# EAGLE design SparkFun-NEO-F9P (EAGLE 9.6.2)
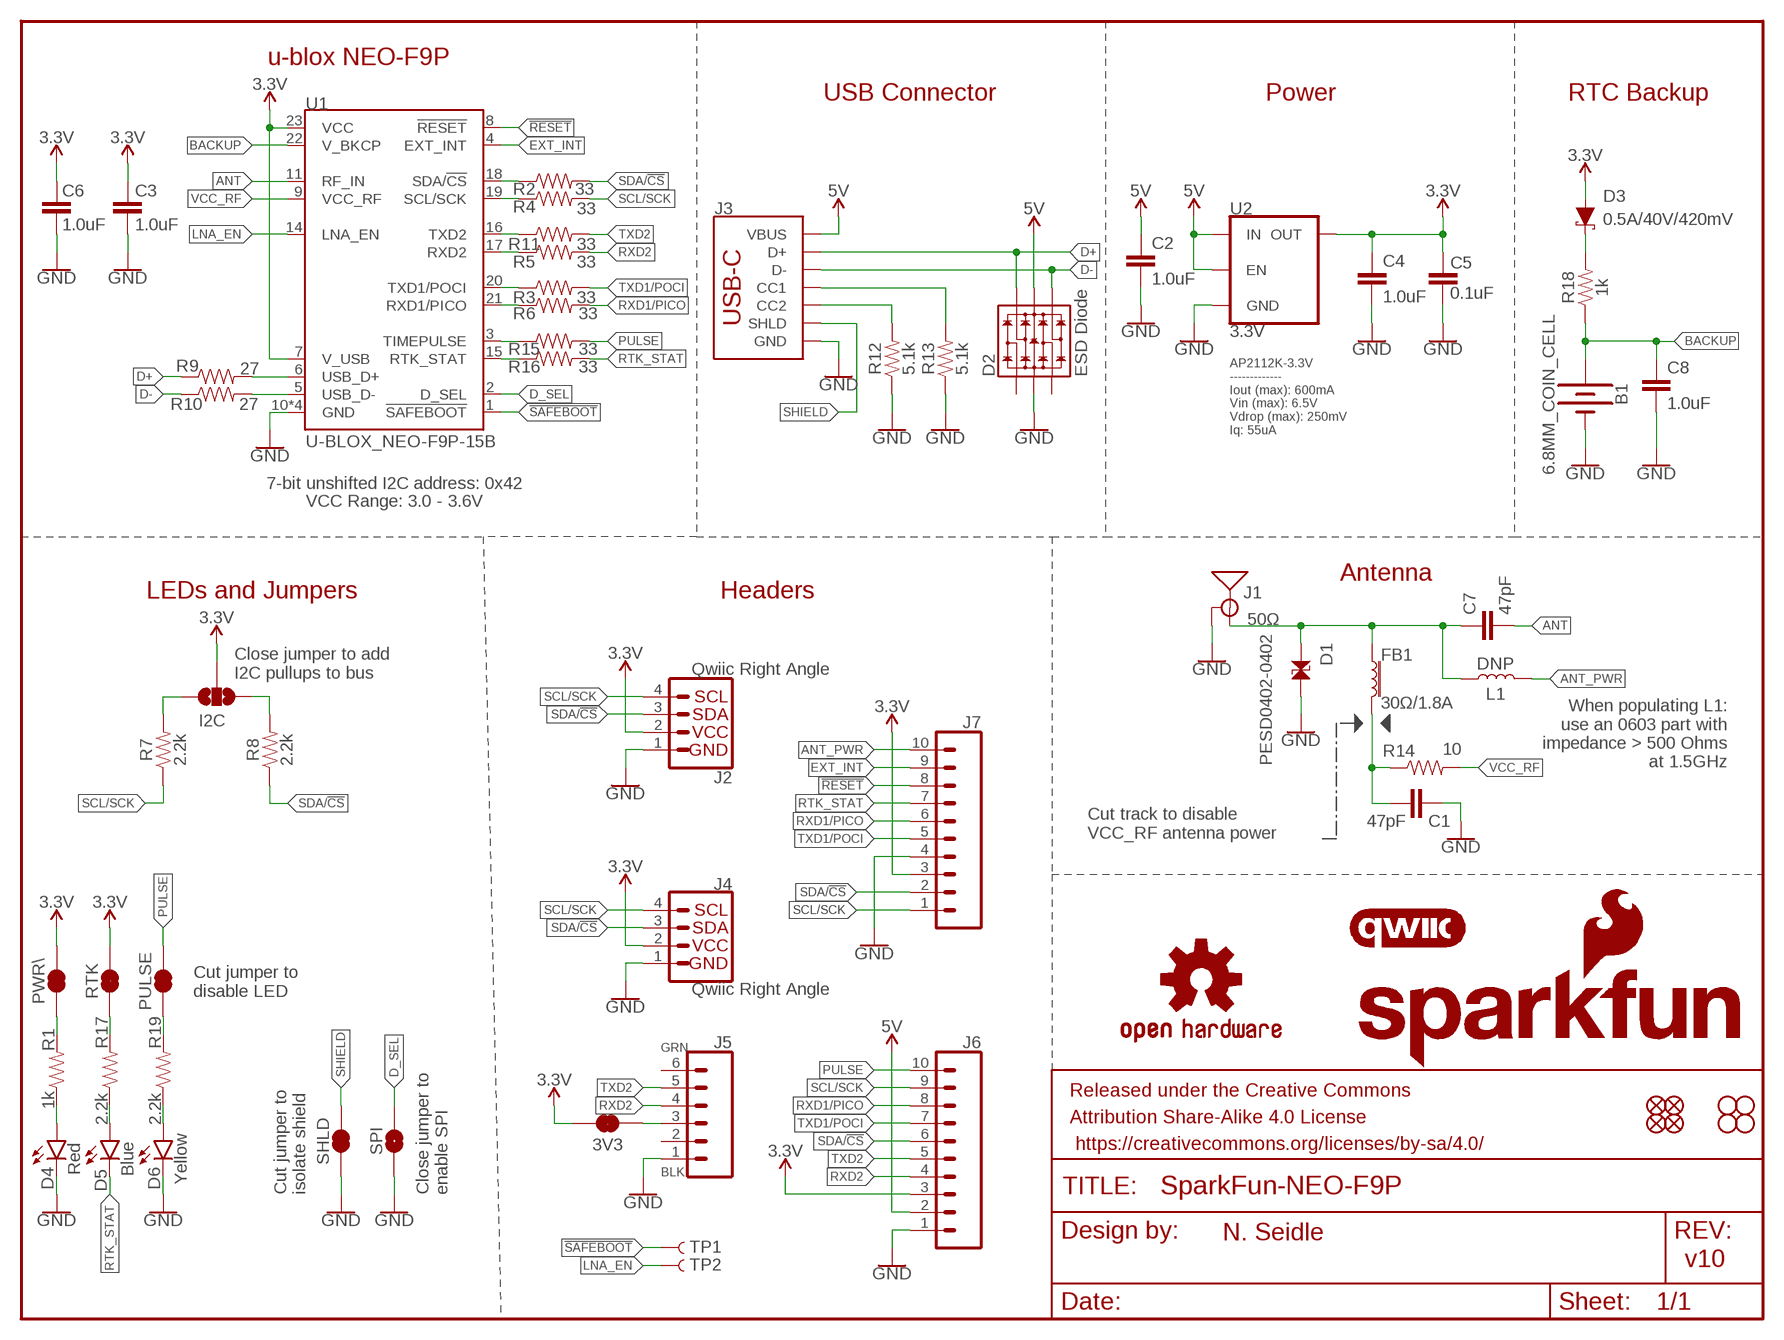
[diagram p0: schematic, sheet 1]

## Parts
3V3  JUMPER-SMT_2_NC_TRACE_SILK  [SMT-JUMPER_2_NC_TRACE_SILK]
B1  6.8MM_COIN_CELL  ML414H_IV01E_BATTERY  [ML414H_IV01E]
C1  47pF  47PF-0603-50V-5%  [0603]
C2  1.0uF  1.0UF-0603-16V-10%  [0603]
C3  1.0uF  1.0UF-0603-16V-10%  [0603]
C4  1.0uF  1.0UF-0603-16V-10%  [0603]
C5  0.1uF  0.1UF-0603-25V-(+80/-20%)  [0603]
C6  1.0uF  1.0UF-0603-16V-10%  [0603]
C7  47pF  47PF-0603-50V-5%  [0603]
C8  1.0uF  1.0UF-0603-16V-10%-X7R  [0603]
D1  PESD0402-0402  [0402]
D2  ESD Diode  TVS_DIODE_ARRAY_DT1042-04SO-7  [SOT-23-6]
D3  0.5A/40V/420mV  DIODE-SCHOTTKY-PMEG4005EJ  [SOD-323]
D4  Red  LED-RED0603  [LED-0603]
D5  Blue  LED-BLUE0603  [LED-0603]
D6  Yellow  LED-YELLOW0603  [LED-0603]
FB1  30Ω/1.8A  FERRITE_BEAD-0603  [0603]
FRAME1  FRAME-LETTER  [CREATIVE_COMMONS]
I2C  JUMPER-SMT_3_NO_SILK  [SMT-JUMPER_3_NO_SILK]
J1  ANTENNA-SMA-GROUNDEDEDGE_SMA  [SMA-EDGE]
J2  Qwiic Right Angle  I2C_STANDARDQWIIC  [JST04_1MM_RA]
J3  USB_C_2-LAYER_PADS  [USB-C-16P-2LAYER-PADS]
J4  Qwiic Right Angle  I2C_STANDARDQWIIC  [JST04_1MM_RA]
J5  CONN_06NO_SILK_FEMALE_PTH  [1X06_NO_SILK]
J6  CONN_10NO_SILK_PTH_FEMALE  [1X10_NO_SILK]
J7  CONN_10NO_SILK_PTH_FEMALE  [1X10_NO_SILK]
JP21  FIDUCIALUFIDUCIAL  [MICRO-FIDUCIAL]
JP31  STAND-OFF  [STAND-OFF]
JP41  STAND-OFF  [STAND-OFF]
JP61  FIDUCIALUFIDUCIAL  [MICRO-FIDUCIAL]
JP71  FIDUCIALUFIDUCIAL  [MICRO-FIDUCIAL]
JP81  FIDUCIALUFIDUCIAL  [MICRO-FIDUCIAL]
JP91  STAND-OFF  [STAND-OFF]
JP101  STAND-OFF  [STAND-OFF]
L1  DNP  DNP-0603_NO-CREAM  [0603_NO-CREAM]
LOGO2  SFE_LOGO_NAME_FLAME.1_INCH  [SFE_LOGO_NAME_FLAME_.1]
LOGO3  SFE_LOGO_NAME_FLAME7_MM  [SFE_LOGO_NAME_FLAME_7MM]
LOGO4  OSHW-LOGOS  [OSHW-LOGO-S]
LOGO5  QWIIC_LOGO_5MM  [QWIIC_5MM]
PULSE  JUMPER-SMT_2_NC_TRACE_SILK  [SMT-JUMPER_2_NC_TRACE_SILK]
PWR\  JUMPER-SMT_2_NC_TRACE_SILK  [SMT-JUMPER_2_NC_TRACE_SILK]
R1  1k  1KOHM-0603-1/10W-1%  [0603]
R2  33  33OHM-0603-1/10W-1%  [0603]
R3  33  33OHM-0603-1/10W-1%  [0603]
R4  33  33OHM-0603-1/10W-1%  [0603]
R5  33  33OHM-0603-1/10W-1%  [0603]
R6  33  33OHM-0603-1/10W-1%  [0603]
R7  2.2k  2.2KOHM-0603-1/10W-1%  [0603]
R8  2.2k  2.2KOHM-0603-1/10W-1%  [0603]
R9  27  27OHM-0603-1/10W-1%  [0603]
R10  27  27OHM-0603-1/10W-1%  [0603]
R11  33  33OHM-0603-1/10W-1%  [0603]
R12  5.1k  5.1KOHM5.1KOHM-0603-1/10W-1%  [0603]
R13  5.1k  5.1KOHM5.1KOHM-0603-1/10W-1%  [0603]
R14  10  10OHM-0603-1/10W-1%  [0603]
R15  33  33OHM-0603-1/10W-1%  [0603]
R16  33  33OHM-0603-1/10W-1%  [0603]
R17  2.2k  2.2KOHM-0603-1/10W-1%  [0603]
R18  1k  1KOHM-0603-1/10W-1%  [0603]
R19  2.2k  2.2KOHM-0603-1/10W-1%  [0603]
RTK  JUMPER-SMT_2_NC_TRACE_SILK  [SMT-JUMPER_2_NC_TRACE_SILK]
SHLD  JUMPER-SMT_2_NC_TRACE_SILK  [SMT-JUMPER_2_NC_TRACE_SILK]
SPI  JUMPER-SMT_2_NO_SILK  [SMT-JUMPER_2_NO_SILK]
TP1  TEST-POINTPOGO_PTH  [1X01_NO_SILK]
TP2  TEST-POINTPOGO_PTH  [1X01_NO_SILK]
U1  U-BLOX_NEO-F9P-15B  [NEO-M9N/M8T/M8U/D9S/F9P]
U2  3.3V  V_REG_AP2112K-3.3V  [SOT23-5]

## Nets
3.3V [3.3V]: 3V3.2 C3.1 C4.1 C5.2 C6.1 D3.A I2C.2 J2.2 J4.2 J6.3 J7.3 PWR\.2 RTK.2 U1.7(V_USB) U1.23(VCC) U2.5(OUT)
5V: C2.1 D2.5(VCC) J3.VBUS1(VBUS) J3.VBUS2(VBUS) J6.2 U2.1(IN) U2.3(EN)
!RESET!: J7.8 U1.8(!RESET!)
!SAFEBOOT!: TP1.1 U1.1(!SAFEBOOT!)
ANT: C7.2 U1.11(RF_IN)
ANT_PWR: J7.10 L1.2
ANT_VCC: C1.1 FB1.2 R14.1
BACKUP: B1.+ C8.1 R18.1 U1.22(V_BKCP)
D+: D2.6(IO4) J3.A6(D+) J3.B6(D+) R9.1
D-: D2.4(IO3) J3.A7(D-) J3.B7(D-) R10.1
D_SEL: SPI.2 U1.2(D_SEL)
EXT_INT: J7.9 U1.4(EXT_INT)
GND: B1.- C1.2 C2.2 C3.2 C4.2 C5.1 C6.2 C8.2 D1.2 D2.2(VSS) D4.C D6.C J1.GND@0(GND) J1.GND@1(GND) J1.GND@2(GND) J1.GND@3(GND) J2.1 J3.GND J3.GND2(GND) J4.1 J5.1 J6.1 J7.4 R12.1 R13.1 SHLD.1 SPI.1 U1.10(GND) U1.12(GND) U1.13(GND) U1.24(GND) U2.2(GND)
LNA_EN: TP2.1 U1.14(LNA_EN)
N$1: PWR\.1 R1.2
N$2: R3.1 U1.20(TXD1/POCI)
N$3: R2.1 U1.18(SDA/!CS!)
N$4: R4.1 U1.19(SCL/SCK)
N$5: I2C.1 R8.2
N$6: R6.1 U1.21(RXD1/PICO)
N$7: J3.B5(CC2) R12.2
N$8: I2C.3 R7.2
N$9: J3.A5(CC1) R13.2
N$10: D4.A R1.1
N$11: R9.2 U1.6(USB_D+)
N$12: R10.2 U1.5(USB_D-)
N$13: 3V3.1 J5.3
N$14: R11.1 U1.16(TXD2)
N$15: R5.1 U1.17(RXD2)
N$16: R15.1 U1.3(TIMEPULSE)
N$17: R16.1 U1.15(RTK_STAT)
N$18: D5.A R17.1
N$19: R17.2 RTK.1
N$20: D3.C R18.2
N$21: D6.A R19.1
N$22: PULSE.1 R19.2
PULSE: J6.10 PULSE.2 R15.2
RTK_STAT: D5.C J7.7 R16.2
RXD1/PICO: J6.8 J7.6 R6.2
RXD2: J5.4 J6.4 R5.2
SCL/SCK: J2.4 J4.4 J6.9 J7.1 R4.2 R7.1
SDA/!CS!: J2.3 J4.3 J6.6 J7.2 R2.2 R8.1
SHIELD: J3.SHLD1(SHLD) J3.SHLD2(SHLD) J3.SHLD3(SHLD) J3.SHLD4(SHLD) SHLD.2
SMA: C7.1 D1.1 FB1.1 J1.SIG(SIGNAL) L1.1
TXD1/POCI: J6.7 J7.5 R3.2
TXD2: J5.5 J6.5 R11.2
VCC_RF: R14.2 U1.9(VCC_RF)
Unconnected: D2.1(IO1) D2.3(IO2) J5.2 J5.6

## Notes on the sheet
- u-blox NEO-F9P
- USB Connector | Power | RTC Backup
- AP2112K-3.3V
  -------------
  Iout (max): 600mA 
  Vin (max): 6.5V
  Vdrop (max): 250mV
  Iq: 55uA
- 7-bit unshifted I2C address: 0x42
- VCC Range: 3.0 - 3.6V
- Antenna
- LEDs and Jumpers | Headers
- 50Ω
- Close jumper to add
  I2C pullups to bus
- When populating L1:
  use an 0603 part with
  impedance > 500 Ohms
  at 1.5GHz
- Cut track to disable
  VCC_RF antenna power
- Cut jumper to 
  disable LED
- GRN
- BLK
- Cut jumper to 
  isolate shield
- Close jumper to
  enable SPI
- N. Seidle
- v10

## Library data of the parts
3V3 PULSE PWR\ RTK SHLD = SparkFun-Jumpers:JUMPER-SMT_2_NC_TRACE: Normally closed trace jumper This jumper has a trace between two pads so it's normally closed (NC). Use a razor knife to open the connection. For best results follow the IPC guidelines for cutting traces: Cutout at least 0.063 mm (0.005 in). Remove all loose material to clean up the cut area. Seal the cut with an approved epoxy. Reapply solder to reclose the connection.
B1 = SparkFun-Batteries:ML414H_IV01E_BATTERY: SEIKO ML414H-IV01E Reflowable Lithium Battery ML414H is a rechargeable, coin type battery with features such as Pb-free reflowable (Peak temperature: 260 C) and high temperature heat resistance. Battery Characteristics: 3.1V max voltage Voff is 2V 1mAH 3k series resistor with battery 72 hour charge time from 2.0-3.1V 2.3-2.8V initial charge; PROD_ID: BATT-14267
C1 C7 = SparkFun-Capacitors:47PF: 47pF ceramic capacitors A capacitor is a passive two-terminal electrical component used to store electrical energy temporarily in an electric field.; PROD_ID: CAP-08913
C2-C4 C6 = SparkFun-Capacitors:1.0UF: 1µF ceramic capacitors A capacitor is a passive two-terminal electrical component used to store electrical energy temporarily in an electric field.; PROD_ID: CAP-00868
C5 = SparkFun-Capacitors:0.1UF: 0.1µF ceramic capacitors A capacitor is a passive two-terminal electrical component used to store electrical energy temporarily in an electric field.; PROD_ID: CAP-00810
C8 = SparkFun-Capacitors:1.0UF: 1µF ceramic capacitors A capacitor is a passive two-terminal electrical component used to store electrical energy temporarily in an electric field.; PROD_ID: CAP-13930
D1 = SparkFun-DiscreteSemi:PESD0402: ESD protection diode PESD is used to protect a signal line from ESD.; DIGIKEY_PART: PESD0402-140CT-ND; MOUSE_PART: 650-PESD0402-140; PROD_ID: DIO-15359
D2 = SparkFun-DiscreteSemi:TVS_DIODE_ARRAY; PROD_ID: IC-13538
D3 = SparkFun-DiscreteSemi:DIODE-SCHOTTKY: Schottky diode A Schottky diode is a semiconductor diode which has a low forward voltage drop and a very fast switching action.; PROD_ID: DIO-10955
D4 = SparkFun-LED:LED-RED: Red SMD LED Used in manufacturing of most products at SparkFun Packages: 0603 - KB - KingBright (DIO-17976) SMD 0603 package [Datasheet] <https://www.kingbrightusa.com/images/catalog/SPEC/APT1608SURCK.pdf> 0603 - (DIO-00819, has gone EOL) SMD 0603 package 0603 SMART - SMD 0603 SMART package ( more efficient and expensive)[Product Link] <http://www.osram-os.com/Graphics/XPic2/00077099_0.pdf> 1206 - SMD1206 package [Product Link] <https://www.sparkfun.com/datasheets/DevTools/LilyPad/Q150OVS4.pdff> SparkFun Products: Pro Mini 328 -5V <https://www.sparkfun.com/products/821> RedBoard <https://www.sparkfun.com/products/12757> IOIO-OTG <https://www.sparkfun.com/products/13613>; PROD_ID: DIO-00819; VALUE: RED
D5 = SparkFun-LED:LED-BLUE: Blue SMD LED Used in manufacturing of various products at SparkFun Packages: 0603 - SMD 0603 package [Product Link] <http://www.digikey.com/product-detail/en/SMLE12BC7TT86/511-1589-2-ND/1641808> 1206 - SMD1206 package [Product Link] <http://www.digikey.com/product-detail/en/lite-on-inc/LTST-C150TBKT/160-1643-1-ND/573584> SparkFun Products: ESP8266 Thing-Dev Board <https://www.sparkfun.com/products/13711> RedBoard <https://www.sparkfun.com/products/12757>; PROD_ID: DIO-08575; VALUE: BLUE
D6 = SparkFun-LED:LED-YELLOW: Yellow SMD LED Used in manufacturing several products at SparkFun. Packages: 0603 - SMD 0603 package[Product Link] <http://www.kingbrightusa.com/product.asp?catalog_name=LED&product_id=APT1608SYCK> 0603 -SMART - SMART SMD 0603 package (more efficient/more expensive) [Product Link] <http://www.osram-os.com/osram_os/en/products/product-catalog/led-light-emitting-diodes/smartled-0603/ly-l29k/index.jsp> LilyPad - SMD1206 package[Product Datasheet] <https://www.sparkfun.com/datasheets/DevTools/LilyPad/Q150YUS4.pdf> SparkFun Products: Blynk Board <https://www.sparkfun.com/products/13794> IOIO-OTG <https://www.sparkfun.com/products/13613> XBee Explorer Serial <https://www.sparkfun.com/products/13225>; PROD_ID: DIO-09003
FB1 = SparkFun-Coils:FERRITE_BEAD: Ferrite Bead (blocks, cores, rings, chokes, etc.) Inductor with layers of ferrite used to suppress high frequencies. Often used to isolate high frequency noise. SparkFun Products: IOIO-OTG - V2.2 <https://www.sparkfun.com/products/13613> SparkFun SAMD21 Mini Breakout <https://www.sparkfun.com/products/13664> SparkFun 6 Degrees of Freedom Breakout - LSM6DS3 <https://www.sparkfun.com/products/13339> SparkFun SAMD21 Dev Breakout <https://www.sparkfun.com/products/13672> Lilypad MP3 <https://www.sparkfun.com/products/11013>; PROD_ID: NDUC-13805
FRAME1 = SparkFun-Aesthetics:FRAME-LETTER: Schematic Frame - Letter Standard 8.5x11 US Letter frame
I2C = SparkFun-Jumpers:JUMPER-SMT_3_NO: Normally open jumper This jumper has three pads in close proximity to each other. Apply solder to close the connection(s).
J1 = SparkFun-RF:ANTENNA-SMA-GROUNDED: SMA Antenna Connector w/ Ground Edge-mount and SMD SMA connectors for RF Antennas. **4-LAYER BOARD WARNING!!** When designing a 4-layer board using any of the SMD variants, you will need to manually add a cutout polygon on any internal power layers to make sure that you don't end up with exposed copper around the edge of the routed hole for these connectors. Exposed power copper could then short to the connector body - and that would be bad. Why hasn't anyone added the cutout polygons directly to the connector footprint? Well, your internal layers (usually 2 and 15) may be covered with GND polygons and you might well want the copper to go all the way to the edge, especially under the connector SIGNAL pin. So adding cutouts to the footprint might make matters worse, not better...; PROD_ID: CONN-08289
J2 J4 = SparkFun-Connectors:I2C_STANDARD: SparkFun I2C Standard Pinout Header SparkFun has standardized on a pinout for all I2C based sensor breakouts. This pinout allows I2C boards to be plugged directly into the headers on Arduino Uno compatible boards, and to be daisy chained easily. Example SparkFun Products: SparkFun Atmospheric Sensor Breakout - BME280 <https://www.sparkfun.com/products/13676> SparkFun Altitude/Pressure Sensor Breakout - MPL3115A2 <https://www.sparkfun.com/products/11084> SparkFun TOF Range Finder Sensor - VL6180 <https://www.sparkfun.com/products/12785>; PROD_ID: CONN-13694
J3 = SparkFun-Connectors:USB_C: USB Type C 16Pin Connector Super Speed pins not available on the 16-pin purely SMD connector so this part is best for USB 2.0 implementations. D1 and D2 are tied together enabling D+/- no matter which way the cable is plugged into the connector. The two channel configuration pins (CC1/2) are exposed. These are normally connected to ground via 5.1k resistors but can be reconfigured for high current/high power applications. **4-LAYER BOARD WARNING!!** If designing 4-layer board, make sure to select the variant _4-LAYER-ISOLATED. The linked footprint (USB-C-16-4LAYER-ISOLATED) includes some very necessary cutout polygons in the inner layers (2 and 15). This prevents the PTH mounting shield legs on the USB connector from electrically connecting any other polygons on the inner layers (usually VCC and GND).; PROD_ID: CONN-14122
J5 = SparkFun-Connectors:CONN_06: Multi connection point. Often used as Generic Header-pin footprint for 0.1 inch spaced/style header connections On any of the 0.1 inch spaced packages, you can populate with these: Break Away Headers - Straight <https://www.sparkfun.com/products/116> (PRT-00116) Break Away Male Headers - Right Angle <https://www.sparkfun.com/products/553> (PRT-00553) Female Headers <https://www.sparkfun.com/products/115> (PRT-00115) Break Away Headers - Machine Pin <https://www.sparkfun.com/products/117> (PRT-00117) Break Away Female Headers - Swiss Machine Pin <https://www.sparkfun.com/products/743> (PRT-00743) Arduino Stackable Header - 6 Pin <https://www.sparkfun.com/products/9280> (PRT-09280) Screw Terminals 2.54mm Pitch (6-Pin) <https://www.sparkfun.com/products/16499> (PRT-16499) For SCREWTERMINALS and SPRING TERMINALS visit here: Screw Terimnals on SparkFun.com <https://www.sparkfun.com/search/results?term=Screw+Terminals> (5mm/3.5mm/2.54mm spacing) This device is also useful as a general connection point to wire up your design to another part of your project. Our various solder wires solder well into these plated through hole pads. Hook-Up Wire - Assortment (Stranded, 22 AWG) <https://www.sparkfun.com/products/11375> (PRT-11375) Hook-Up Wire - Assortment (Solid Core, 22 AWG) <https://www.sparkfun.com/products/11367> (PRT-11367) View the entire wire category on our website here <https://www.sparkfun.com/categories/141>; PROD_ID: CONN-08437
J6 J7 = SparkFun-Connectors:CONN_10: Multi connection point. Often used as Generic Header-pin footprint for 0.1 inch spaced/style header connections On any of the 0.1 inch spaced packages, you can populate with these: Break Away Headers - Straight <https://www.sparkfun.com/products/116> (PRT-00116) Break Away Male Headers - Right Angle <https://www.sparkfun.com/products/553> (PRT-00553) Female Headers <https://www.sparkfun.com/products/115> (PRT-00115) Break Away Headers - Machine Pin <https://www.sparkfun.com/products/117> (PRT-00117) Break Away Female Headers - Swiss Machine Pin <https://www.sparkfun.com/products/743> (PRT-00743) Arduino Stackable Header - 10 Pin <https://www.sparkfun.com/products/11376> (PRT-11376) For SCREWTERMINALS and SPRING TERMINALS visit here: Screw Terimnals on SparkFun.com <https://www.sparkfun.com/search/results?term=Screw+Terminals> (5mm/3.5mm/2.54mm spacing) This device is also useful as a general connection point to wire up your design to another part of your project. Our various solder wires solder well into these plated through hole pads. Hook-Up Wire - Assortment (Stranded, 22 AWG) <https://www.sparkfun.com/products/11375> (PRT-11375) Hook-Up Wire - Assortment (Solid Core, 22 AWG) <https://www.sparkfun.com/products/11367> (PRT-11367) View the entire wire category on our website here <https://www.sparkfun.com/categories/141> Special notes: Molex polarized connector foot print use with SKU : PRT-08231 with associated crimp pins and housings. 1MM SMD Version SKU: PRT-10208 NOTES ON THE VARIANTS LOCK and LOCK_LONGPADS... This footprint was designed to help hold the alignment of a through-hole component (i.e. 6-pin header) while soldering it into place. You may notice that each hole has been shifted either up or down by 0.005 of an inch from it's more standard position (which is a perfectly straight line). This slight alteration caused the pins (the squares in the middle) to touch the edges of the holes. Because they are alternating, it causes a "brace" to hold the component in place. 0.005 has proven to be the perfect amount of "off-center" position when using our standard breakaway headers. Although looks a little odd when you look at the bare footprint, once you have a header in there, the alteration is very hard to notice. Also,if you push a header all the way into place, it is covered up entirely on the bottom side.
JP21 JP61 JP71 JP81 = SparkFun:FIDUCIAL: Fiducial Alignment Points Various fiducial points for machine vision alignment.
JP31 JP41 JP91 JP101 = SparkFun:STAND-OFF: Stand Off This is the mechanical footprint for a #4 phillips button head screw. Use the keepout ring to avoid running the screw head into surrounding components. SKU : PRT-00447
L1 = SparkFun-Coils:DNP
LOGO2 LOGO3 = SparkFun-Aesthetics:SFE_LOGO_NAME_FLAME: SparkFun Font Logo w/ Flame This is the SparkFun full logo. The logo on the schematic will always be the same size; the package variant is the height of the flame part of the logo. Default layer for the logo on the board is tSilk.
LOGO4 = SparkFun-Aesthetics:OSHW-LOGO: Open-Source Hardware (OSHW) Logo This logo indicates the piece of hardware it is found on incorporates a OSHW license and/or adheres to the definition of open source hardware found here: http://freedomdefined.org/OSHW
LOGO5 = SparkFun-Aesthetics:QWIIC_LOGO: Qwiic Logos for placement on schematic and PCB. The 5.5mm silk logo is best for placing next to Qwiic connector.
R1 R18 = SparkFun-Resistors:1KOHM: 1kΩ resistor A resistor is a passive two-terminal electrical component that implements electrical resistance as a circuit element. Resistors act to reduce current flow, and, at the same time, act to lower voltage levels within circuits. - Wikipedia; PROD_ID: RES-07856
R2-R6 R11 R15 R16 = SparkFun-Resistors:33OHM: 33Ω resistor A resistor is a passive two-terminal electrical component that implements electrical resistance as a circuit element. Resistors act to reduce current flow, and, at the same time, act to lower voltage levels within circuits. - Wikipedia; PROD_ID: RES-08270
R7 R8 R17 R19 = SparkFun-Resistors:2.2KOHM: 2.2kΩ resistor A resistor is a passive two-terminal electrical component that implements electrical resistance as a circuit element. Resistors act to reduce current flow, and, at the same time, act to lower voltage levels within circuits. - Wikipedia; PROD_ID: RES-08272
R9 R10 = SparkFun-Resistors:27OHM: 27Ω resistor A resistor is a passive two-terminal electrical component that implements electrical resistance as a circuit element. Resistors act to reduce current flow, and, at the same time, act to lower voltage levels within circuits. - Wikipedia; PROD_ID: RES-09334
R12 R13 = SparkFun-Resistors:5.1KOHM; PROD_ID: RES-12083
R14 = SparkFun-Resistors:10OHM: 10Ω resistor A resistor is a passive two-terminal electrical component that implements electrical resistance as a circuit element. Resistors act to reduce current flow, and, at the same time, act to lower voltage levels within circuits. - Wikipedia; PROD_ID: RES-12581
SPI = SparkFun-Jumpers:JUMPER-SMT_2_NO: Normally open jumper This jumper has two pads in close proximity to each other. Apply solder to close the connection. Round pads are easier to solder for beginners, but are a lot larger. SparkFun Product that uses the round pads: SparkFun EL Sequencer <https://www.sparkfun.com/products/12781>
TP1 TP2 = SparkFun-Connectors:TEST-POINT: SparkFun Test Points Bare copper test points for troubleshooting or In-Circuit-Testing. These are used by our Production team for verifying production board runs using pogo-pins on test beds. SparkFun Products: SparkFun LSM9DS1 Breakout <https://www.sparkfun.com/products/13284> SparkFun PSOC <https://www.sparkfun.com/products/13714> SparkFun Load Cell Amplifier <https://www.sparkfun.com/products/13879>
U1 = SparkFun-GPS:U-BLOX_NEO-F9P; PROD_ID: IC-19498
U2 = SparkFun-IC-Power:V_REG_AP2112: AP2112 - 600mA CMOS LDO Regulator w/ Enable The AP2112 is CMOS process low dropout linear regulator with enable function, the regulator delivers a guaranteed 600mA (min.) continuous load current. Features Output Voltage Accuracy: ±1.5% Output Current: 600mA (Min.) Foldback Short Current Protection: 50mA Enable Function to Turn ON/OFF VOUT Low Dropout Voltage (3.3V): 250mV (Typ.) @IOUT=600mA Excellent Load Regulation: 0.2%/A (Typ.) Excellent Line Regulation: 0.02%/V (Typ.) Low Quiescent Current: 55μA (Typ.) Low Standby Current: 0.01μA (Typ.) Low Output Noise: 50μVRMS PSRR: 100Hz -65dB, 1kHz -65dB OTSD Protection Stable with 1.0μF Flexible Cap: Ceramic, Tantalum and Aluminum Electrolytic Operation Temperature Range: -40°C to 85°C ESD: MM 400V, HBM 4000V; PROD_ID: VREG-12457

## Net classes
1 vcc: width 0.152 mm
2 3.3V: width 0.508 mm

## Board
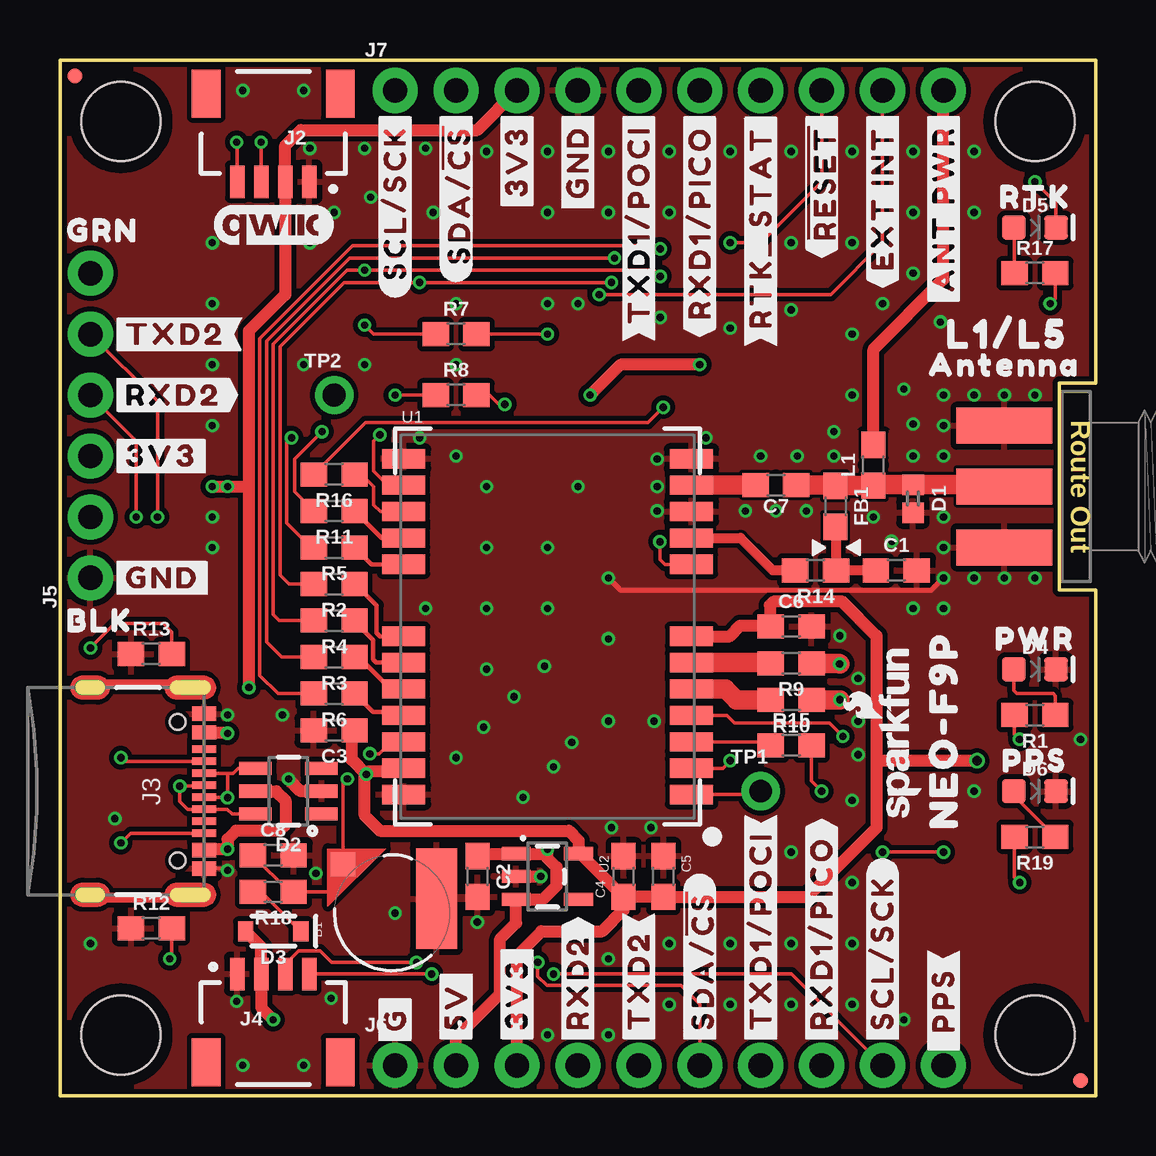
[diagram p1: board, top side]
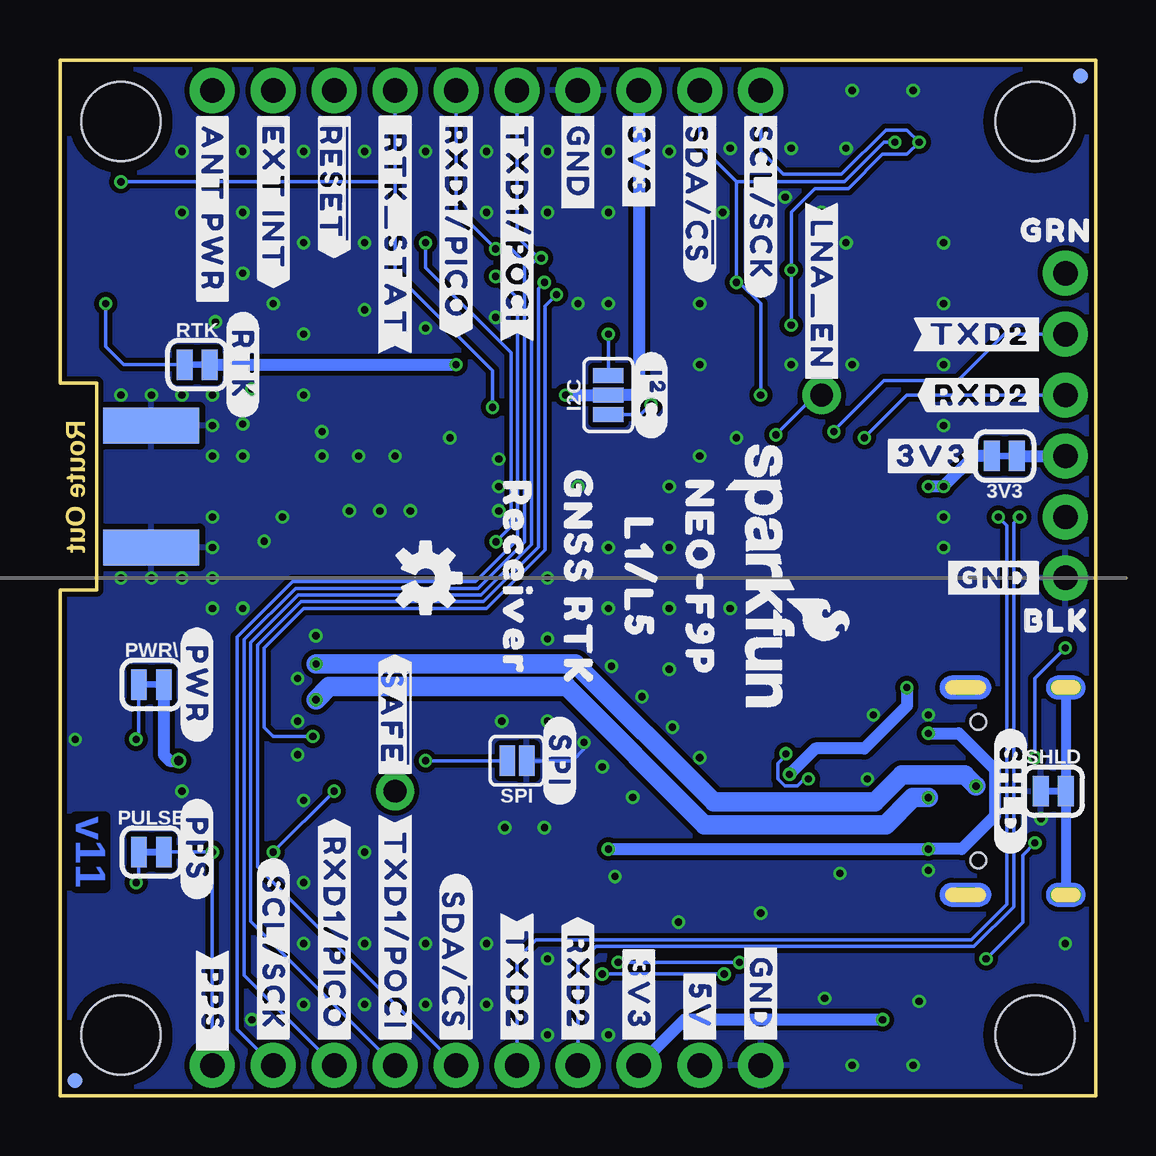
[diagram p2: board, bottom side, seen from below]

Size 43.18 x 43.18 mm. Coordinates in mm from the lower left corner, seen from the top.
Outline: 0,0 0,43.18 43.18,43.18 43.18,29.72 41.66,29.72 41.66,21.08 43.18,21.08 43.18,0 0,0
Copper layers (1*16): Top 0.035mm / dielectric 1.5mm / Bottom 0.035mm
Design rules "SparkFun-2-Layer-Minimum-JLCPCB": minimum track width 5mil, minimum drill 0.3mm, track to track 5mil, track to pad 5mil, pad to pad 5mil, via to via 5mil, smd to smd 5mil, copper to edge 7mil, drill to drill 7mil, minimum pad ring 5mil, minimum via ring 5mil, stop-mask expansion 2.5mil, vias tented up to drill 25mil, thermal gap 10mil
tRestrict: 2 lines

### Footprints (pad centres in the part's own frame; a part is rotated, then mirrored left to right if it is on the bottom)
SMT-JUMPER_2_NC_TRACE_SILK = smd 0.66 x 1.27: 1 -0.521,0; 2 0.521,0
ML414H_IV01E = smd 1 x 1: + 2.022,2.032 | smd 4.2 x 1.7: - 0.6,-1.85
0603 = smd 1.1 x 1: 1 -0.85,0; 2 0.85,0
0402 = smd 0.85 x 0.9: 1 -0.58,0; 2 0.58,0
SOT-23-6 = smd 0.55 x 1.35: 1 -0.95,-1.375; 2 0,-1.375; 3 0.95,-1.375; 4 0.95,1.375; 5 0,1.375; 6 -0.95,1.375
SOD-323 = smd 0.63 x 0.83: A 1.15,0; C -1.15,0
LED-0603 = smd 1 x 1: A -0.877,0; C 0.877,0
SMT-JUMPER_3_NO_SILK = smd 0.635 x 1.27: 1 -0.813,0; 2 0,0; 3 0.813,0
SMA-EDGE = smd 1.5 x 4: GND@0 -2.54,0; GND@1 2.54,0; SIG 0,0 | smd 1.5 x 4 bottom: GND@2 -2.54,0; GND@3 2.54,0
JST04_1MM_RA = smd 0.6 x 1.35: 1 -1.5,0; 2 -0.5,0; 3 0.5,0; 4 1.5,0 | smd 1.2 x 2: NC1 2.8,-3.675; NC2 -2.8,-3.675
USB-C-16P-2LAYER-PADS = smd 0.3 x 1: A5 -1.25,-0.34; A6 -0.25,-0.34; A7 0.25,-0.34; A8 1.25,-0.34; B5 1.75,-0.34; B6 0.75,-0.34; B7 -0.75,-0.34; B8 -1.75,-0.34 | smd 0.6 x 1: GND -3.225,-0.34; GND2 3.225,-0.34; VBUS1 -2.45,-0.34; VBUS2 2.45,-0.34 | drill 0.4 pad 0.6 long: SHLD1 -4.318,-0.915; SHLD2 4.318,-0.915; SHLD3 -4.318,-5.095; SHLD4 4.318,-5.095 | hole 0.65: -2.89,-1.445; 2.89,-1.445
1X06_NO_SILK = drill 1.016 pad 1.88: 1 0,0; 2 2.54,0; 3 5.08,0; 4 7.62,0; 5 10.16,0; 6 12.7,0
1X10_NO_SILK = drill 1.016 pad 1.88: 1 0,0; 2 2.54,0; 3 5.08,0; 4 7.62,0; 5 10.16,0; 6 12.7,0; 7 15.24,0; 8 17.78,0; 9 20.32,0; 10 22.86,0
MICRO-FIDUCIAL = smd 0.635 x 0.635: 1 0,0
STAND-OFF = hole 3.302: 0,0
0603_NO-CREAM = smd 1.1 x 1: 1 -0.85,0; 2 0.85,0
SMT-JUMPER_2_NO_SILK = smd 0.635 x 1.27: 1 -0.406,0; 2 0.406,0
1X01_NO_SILK = drill 0.95 pad 1.6: 1 0,0
NEO-M9N/M8T/M8U/D9S/F9P = smd 1.8 x 0.8: 1 6,-7; 2 6,-5.9; 3 6,-4.8; 4 6,-3.7; 5 6,-2.6; 6 6,-1.5; 7 6,-0.4; 8 6,2.6; 9 6,3.7; 10 6,4.8; 11 6,5.9; 12 6,7; 13 -6,7; 14 -6,5.9; 15 -6,4.8; 16 -6,3.7; 17 -6,2.6; 18 -6,-0.4; 19 -6,-1.5; 20 -6,-2.6; 21 -6,-3.7; 22 -6,-4.8; 23 -6,-5.9; 24 -6,-7
SOT23-5 = smd 0.55 x 1.2: 1 -0.95,-1.3; 2 0,-1.3; 3 0.95,-1.3; 4 0.95,1.3; 5 -0.95,1.3

### Placement (x,y rotation side)
3V3  3.81,26.67 180 bottom
B1  13.84,7.62 90 top
C1  34.86,21.91 0 top
C2  17.4,9.14 270 top
C3  11.43,15.24 180 top
C4  23.5,9.14 90 top
C5  25.15,9.14 270 top
C6  30.48,19.56 0 top
C7  29.84,25.46 180 top
C8  8.89,10.03 0 top
D1  35.56,24.89 270 top
D2  9.53,12.7 90 top
D3  8.89,6.86 180 top
D4  40.64,17.78 0 top
D5  40.64,36.2 0 top
D6  40.64,12.7 0 top
FB1  32.32,24.57 270 top
FRAME1  -7.62,-17.78 0 top  (outside the outline)
I2C  20.32,29.21 90 bottom
J1  39.37,25.4 270 top
J2  8.89,38.1 180 top
J3  6.35,12.7 270 top
J4  8.89,5.08 0 top
J5  1.27,21.59 90 top
J6  13.97,1.27 0 top
J7  13.97,41.91 0 top
JP21  42.55,0.64 0 top
JP31  2.54,40.61 0 top
JP41  40.64,40.61 0 top
JP61  0.64,42.52 0 top
JP71  42.55,0.64 0 bottom
JP81  0.64,42.52 0 bottom
JP91  2.54,2.54 0 top
JP101  40.64,2.54 0 top
L1  33.91,26.29 90 top
LOGO1  SPECIAL_INSTRUCTIONS-ORDERING  [ORDERING_INSTRUCTIONS]  54.61,50.8 0 top  (outside the outline)
LOGO2  13.97,21.59 270 bottom
LOGO3  34.92,15.11 90 top
LOGO4  27.94,21.59 270 bottom
LOGO5  8.89,36.32 0 top
PULSE  39.37,10.16 0 bottom
PWR\  39.37,17.14 0 bottom
R1  40.64,15.88 180 top
R2  11.43,21.34 180 top
R3  11.43,18.29 180 top
R4  11.43,19.81 180 top
R5  11.43,22.86 180 top
R6  11.43,16.76 180 top
R7  16.51,31.75 0 top
R8  16.51,29.21 0 top
R9  30.48,18.03 180 top
R10  30.48,16.51 180 top
R11  11.43,24.38 180 top
R12  3.81,6.99 0 top
R13  3.81,18.41 0 top
R14  31.5,21.91 180 top
R15  30.48,14.61 0 top
R16  11.43,25.91 180 top
R17  40.64,34.29 0 top
R18  8.89,8.51 180 top
R19  40.64,10.79 180 top
RTK  37.47,30.48 0 bottom
SHLD  1.78,12.7 0 bottom
SPI  24.13,13.97 180 bottom
TP1  29.21,12.7 0 top
TP2  11.43,29.21 0 top
U1  20.32,19.56 0 top
U2  20.32,9.14 270 top
U$2  [#GND#0]  2.03,21.59 0 top
U$3  [#GND#0]  21.59,41.15 270 bottom
U$4  [#GND#1]  21.59,41.15 90 top
U$5  [#GND#1]  2.03,21.59 0 bottom
U$6  [#GND#1]  13.97,2.03 270 bottom
U$7  [#TXD2#0]  2.03,31.75 0 top
U$8  [#TXD2#0]  24.13,2.03 90 top
U$9  [#TXD2#3]  24.13,2.03 270 bottom
U$10  [#TXD2#3]  2.03,31.75 0 bottom
U$11  [#RXD2#0]  21.59,2.03 90 top
U$12  [#RXD2#0]  2.03,29.21 0 top
U$13  [#RXD2#3]  2.03,29.21 0 bottom
U$14  [#RTK_STAT#0]  29.21,36.2 90 top
U$15  [#RXD2#3]  21.59,2.03 270 bottom
U$16  [BLK0]  1.65,19.81 0 top
U$17  [BLK0]  1.65,19.81 0 bottom
U$18  [GRN0]  1.78,36.07 0 top
U$19  [GRN0]  1.65,36.07 0 bottom
U$20  [#5V#0]  16.51,2.03 90 top
U$21  [#5V#6]  16.51,2.03 270 bottom
U$22  [#3V3#0]  19.05,2.03 90 top
U$23  [#3V3#0]  19.05,41.15 270 bottom
U$24  [#3V3#4]  19.05,2.03 270 bottom
U$25  [#3V3#4]  19.05,41.15 90 top
U$26  [#SDA##CS##0]  26.67,2.03 90 top
U$27  [#SDA##CS##0]  16.51,41.15 270 bottom
U$28  [#SDA##CS##1]  26.67,2.03 270 bottom
U$29  [#SDA##CS##1]  16.51,41.15 90 top
U$30  [#TXD1#POCI#0]  29.21,2.03 90 top
U$31  [#TXD1#POCI#0]  24.13,41.15 270 bottom
U$32  [#TXD1#POCI#2]  24.13,41.15 90 top
U$33  [#TXD1#POCI#2]  29.21,2.03 270 bottom
U$34  [#RXD1#PICO#0]  31.75,2.03 90 top
U$35  [#RXD1#PICO#0]  26.67,41.15 270 bottom
U$36  [#RXD1#PICO#2]  26.67,41.15 90 top
U$37  [#RXD1#PICO#2]  31.75,2.03 270 bottom
U$38  [#_RTK_STAT#0]  29.21,36.07 270 bottom
U$39  [#SCL#SCK#0]  34.29,2.03 90 top
U$40  [#SCL#SCK#0]  13.97,41.15 270 bottom
U$41  [#SCL#SCK#1]  13.97,41.15 90 top
U$42  [#SCL#SCK#1]  34.29,2.03 270 bottom
U$43  [#RTK#0]  35.56,30.48 270 bottom
U$44  [L1#L50]  39.5,31.75 0 top
U$45  [##RESET##0]  31.75,41.15 90 top
U$46  [##RESET##1]  31.75,41.15 270 bottom
U$47  [#EXT_INT#0]  34.29,41.15 90 top
U$48  [#EXT_INT#1]  34.29,41.15 270 bottom
U$49  [PWR0]  40.64,19.05 0 top
U$50  [#PWR#0]  37.47,17.14 270 bottom
U$51  [#SPI#0]  22.35,13.97 270 bottom
U$52  [#I�C#0]  18.54,29.21 270 bottom
U$53  [#SHLD#0]  3.56,12.7 270 bottom
U$54  [RTK0]  40.64,37.47 0 top
U$55  [#G#0]  13.97,3.17 90 top
U$56  [#3V3#0]  2.03,26.67 0 top
U$57  [#3V3#0]  9.02,26.67 0 bottom
U$58  [#ANT_PWR#0]  36.83,41.15 90 top
U$59  [#ANT_PWR#1]  36.83,41.15 270 bottom
U$60  [NEO#F9P0]  16.51,21.59 270 bottom
U$61  [NEO#F9P0]  36.83,15.24 90 top
U$63  [ANTENNA0]  39.37,30.48 0 top
U$64  [L1#L50]  19.05,21.59 270 bottom
U$65  [GNSS_RTK0]  21.59,21.59 270 bottom
U$66  [RECEIVER0]  24.13,21.59 270 bottom
U$67  [#LNA_EN#0]  11.43,33.4 270 bottom
U$68  [PPS0]  40.64,13.97 0 top
U$69  [#PPS#0]  37.47,10.29 270 bottom
U$70  [#_PPS#0]  36.83,3.81 90 top
U$71  [#PPS_#0]  36.83,3.81 270 bottom
U$72  [##SAFE##0]  29.21,15.75 270 bottom

### Tracks (layer width: path | path; a pad name or v marks a point on that pad's centre or on a via)
3.3V  (via drill 0.3, 0.38)
  Top 0.508: C4.1 C5.2 31.15,8.29 34.04,11.18 34.04,13.97 | 34.04,13.97 34.04,19.18 32.62,20.6 29.74,20.6 29.59,20.45 29.59,19.6 | 29.59,19.6 C6.1 | 29.59,19.6 28.36,19.6 27.92,19.16 U1.7 | v6.35,25.4 v6.99,25.4 7.87,25.4 | 7.87,25.4 7.87,31.88 9.39,33.4 J2.2 9.39,39.62 10.03,40.26 17.4,40.26 J7.3 | 7.87,25.4 v7.87,17.02 | U1.23 14.19,13.53 12.9,13.53 v12.77,13.4 | v12.77,13.4 12.7,13.34 12.7,11.68 13.34,11.05 21.21,11.05 21.62,10.64 U2.5 21.7,10.09 C4.1 | v38.23,13.97 34.04,13.97 | J6.3 19.05,5.84 20.07,6.86 22.61,6.86 23.5,7.75 C4.1 | D3.A 8.39,6.21 J4.2 8.39,3.67 v8.89,3.17 | C3.1 12.15,15.11 12.15,14.02 v12.77,13.4 | v26.67,30.48 23.37,30.48 v22.1,29.21
  Bottom 0.508: 3V3.2 5.09,26.67 6.35,25.41 v6.35,25.4 v6.99,25.4 | J7.3 19.05,29.46 19.3,29.21 I2C.2 v22.1,29.21 | PWR\.2 38.85,14.21 38.61,13.97 v38.23,13.97 | v7.87,17.02 7.87,16.26 9.65,14.48 11.7,14.48 v12.77,13.4 | v8.89,3.17 17.14,3.17 J6.3 | RTK.2 v26.67,30.48
5V  (via drill 0.3)
  Top 0.508: J3.VBUS1 6.95,15.15 v6.99,15.11 | J3.VBUS2 6.05,10.29 v6.99,10.29 v6.98,10.29 6.98,10.69 7.34,11.05 9.14,11.05 9.4,11.3 9.4,12.32 9.02,12.7 D2.5 | C2.1 17.5,10.09 U2.1 20.13,10.09 v20.32,10.29 20.32,9.91 20.7,9.53 20.7,8.76 20.13,8.19 U2.3 19.02,7.21 18.35,6.54 18.35,4.25 16.51,2.41 J6.2
  Bottom 0.508: v6.99,15.11 5.71,15.11 4.21,13.61 4.21,11.67 5.59,10.29 v6.99,10.29 v20.32,10.29
!RESET!  (via drill 0.3)
  Top 0.152: J7.8 31.75,38.1 29.21,35.56 v27.94,35.56 | U1.8 25.21,22.16 25.01,22.36 v25.01,23.1
  Bottom 0.152: v25.01,23.1 24.38,23.72 24.38,30.97 27.94,34.53 v27.94,35.56
!SAFEBOOT!
  Top 0.152: U1.1 29.07,12.56 TP1.1
ANT
  Top 0.813: C7.2 U1.11
ANT_PWR
  Top 0.508: L1.2 33.91,31.11 36.83,34.04 J7.10
ANT_VCC
  Top 0.406: FB1.2 32.35,23.7 R14.1 C1.1
BACKUP  (via drill 0.3)
  Top 0.152: C8.1 9.56,8.51 R18.1 11.31,8.51 11.81,9.01 B1.+ 11.81,13.04 v11.98,13.21 | v12.92,14.26 13.3,14.26 13.8,14.76 U1.22
  Bottom 0.152: v11.98,13.21 12.16,13.21 12.44,12.92 12.97,12.92 13.25,13.21 13.25,13.86 12.92,14.19 v12.92,14.26
D+  (via drill 0.3)
  Top 0.152: 6.35,11.95 6.97,11.95 7.17,11.75 D2.6 | J3.A6 5.97,12.91 v5,12.91 5,12.28 5.32,11.95 J3.B6
  Top 0.178: J3.B6 6.35,11.95
  Top 0.813: R9.1 32.47,18.03 v32.5,18
  Bottom 0.813: v32.5,18 21.68,18 15.93,12.24 9.22,12.24 8.09,13.37 5.46,13.37 v5,12.91
D-  (via drill 0.3)
  Top 0.152: J3.B7 6.99,13.45 | 6.99,13.45 7.23,13.45 7.43,13.65 D2.4 | J3.A7 6.97,12.45 v6.99,12.43 6.99,13.45
  Top 0.813: R10.1 v32.51,16.51
  Bottom 0.813: v32.51,16.51 31.96,17.06 22.07,17.06 16.32,11.3 8.76,11.3 7.63,12.43 v6.99,12.43
D_SEL  (via drill 0.3)
  Top 0.152: U1.2 27.63,13.66 v27.94,13.97
  Bottom 0.152: v27.94,13.97 SPI.2
EXT_INT  (via drill 0.3)
  Top 0.152: J7.9 34.29,35.56 32.13,33.4 v22.48,33.4 | U1.4 27.8,15.86 28.11,15.55 32.07,15.55 v32.64,14.99
  Bottom 0.152: v32.64,14.99 34.29,14.99 34.67,15.37 34.67,18.67 33.02,20.32 25.4,20.32 22.96,22.76 22.96,32.92 v22.48,33.4
GND  (via drill 0.3)
  Top 0.152: J3.GND2 6.91,9.47 v6.99,9.4
  Top 0.203: v36.83,21.59 36.32,21.08 23.37,21.08 v22.86,21.59
  Top 0.508: D2.2 10.03,12.7 v9.53,13.21 | U2.2 v20.04,9.14
  Bottom 0.152: SPI.1 21.82,13.97 21.34,14.45 v21.34,14.73
  other vias: 14.99,27.43 26.92,27.43 24.89,24.38 28.57,24.38 32.26,27.69 29.84,24.38 31.11,24.38 33.91,24.13 36.83,24.13 36.83,22.86 38.1,21.59 39.37,21.59 40.64,21.59 24.89,26.54 24.89,25.4 29.21,26.67 30.73,26.67 32.26,26.67 34.67,23.11 35.56,26.67 35.56,28 36.83,26.67 36.83,27.94 36.83,29.21 38.1,29.21 39.37,29.21 40.64,29.21 10.41,35.56 10.41,39.5 1.27,6.35 22.99,11.18 24.64,11.18 17.65,15.37 18.92,16.64 20.19,17.91 22.86,19.05 19.3,12.45 20.57,13.72 22.86,15.62 24.77,15.62 32.51,19.18 33.27,17.4 33.27,15.62 7.37,3.94 2.29,11.56 6.99,15.88 20.32,2.54 7.62,1.27 11.3,4.06 13.97,7.62 42.55,14.86 9.27,15.88 12.7,39.5 15.24,39.5 11.43,36.83 15.56,36.83 22.86,39.37 22.86,36.83 27.94,39.37 27.94,32 30.48,35.56 35.56,39.37 35.56,36.83 33.02,35.56 21.59,25.4 20.32,22.86 17.78,25.4 17.78,22.86 17.78,20.32 17.78,17.78 15.24,20.32 6.35,22.86 10.16,30.48 16.51,26.67 16.51,30.48 16.51,33.02 6.35,27.94 6.35,30.48 6.35,35.56 10.16,41.91 7.62,41.91 21.59,33.02 20.32,36.83 35.56,20.32 36.83,20.32 38.1,12.7 33.02,3.81 30.48,3.81 27.94,3.81 25.4,3.81 22.86,2.54 25.4,6.35 27.94,6.35 30.48,10.16 22.86,5.71 33.02,8.89 33.02,12.32 6.35,33.02 30.48,6.35 33.02,39.37 30.48,32.77 33.02,6.35 10.16,1.27 35.18,3.17 17.78,39.37 20.32,39.37 25.4,39.37 25.4,36.83 30.48,39.37 33.27,14.22 20.32,20.32 16.51,14.1 6.35,24.13 35.56,34.29 34.29,33.02 33.02,31.75 35.18,29.46 36.7,32.26 38.1,39.37 38.1,36.83 33.02,29.21 25.02,32.45 12.7,30.48 12.95,37.47 20.32,33.02 17.4,7.24 10.67,9.27
  pour Top (isolate 0.203): 0,43.18 43.18,43.18 43.18,0 0,0
  pour Bottom (isolate 0.203): 0,43.18 43.18,43.18 43.18,0 0,0
  pour Top (isolate 0.127): 25.4,27.69 25.4,23.11 43.18,23.11 43.18,27.69
LNA_EN  (via drill 0.3)
  Top 0.152: U1.14 13.66,25.46 13.08,26.04 13.08,27.3 v13.34,27.56
  Bottom 0.152: v13.34,27.56 11.68,29.21 TP2.1
N$1  (via drill 0.3)
  Top 0.152: R1.2 39.79,15.07 v40.01,14.86
  Bottom 0.152: PWR\.1 39.89,15.76 39.89,14.97 v40.01,14.86
N$2
  Top 0.178: U1.20 13.78,16.96 12.45,18.29 R3.1
N$3
  Top 0.178: U1.18 13.35,19.16 13.21,19.3 13.21,20.45 12.32,21.34 R2.1
N$4
  Top 0.178: U1.19 13.18,18.06 13.05,18.2 13.05,19 12.28,19.77 R4.1
N$5  (via drill 0.3)
  Top 0.152: v18.54,28.83 18.29,28.83 17.91,29.21 R8.2
  Bottom 0.152: I2C.1 18.97,28.4 v18.54,28.83
N$6
  Top 0.178: U1.21 14.2,15.86 14.06,16 13.04,16 R6.1
N$7  (via drill 0.3)
  Top 0.152: J3.B5 2.95,10.95 v2.54,10.54 | v4.57,5.71 4.66,5.8 R12.2
  Bottom 0.152: v2.54,10.54 3.05,10.03 3.05,7.24 v4.57,5.71
N$8  (via drill 0.3)
  Top 0.152: v20.32,31.75 R7.2
  Bottom 0.152: I2C.3 v20.32,31.75
N$9  (via drill 0.3)
  Top 0.152: J3.A5 2.69,13.95 v2.54,14.1 | v1.27,18.67 2.29,19.68 4.32,19.68 4.66,19.34 R13.2
  Bottom 0.152: v2.54,14.1 2.54,17.4 v1.27,18.67
N$10
  Top 0.152: R1.1 41.49,16.68 41.4,16.76 39.88,16.76 39.75,16.89 39.75,17.77 D4.A
N$11
  Top 0.813: R9.2 29.61,18.06 U1.6
N$12
  Top 0.813: U1.5 27.75,16.96 28.19,16.51 R10.2
N$13
  Bottom 0.508: 3V3.1 J5.3
N$14
  Top 0.178: U1.16 13.41,23.26 R11.1
N$15
  Top 0.178: U1.17 12.98,22.16 R5.1
N$16
  Top 0.152: R15.1 29.48,14.76 U1.3
N$17
  Top 0.152: U1.15 13.36,24.36 13.08,24.64 13.08,25.4 12.57,25.91 R16.1
N$18
  Top 0.152: R17.1 39.79,36.17 D5.A
N$19  (via drill 0.3)
  Top 0.152: R17.2 41.49,33.23 v41.27,33.02
  Bottom 0.152: v41.27,33.02 41.27,31.23 40.53,30.48 RTK.1
N$20
  Top 0.152: D3.C 8.39,8.51 R18.2
N$21
  Top 0.152: R19.1 39.76,12.52 D6.A
N$22  (via drill 0.3)
  Top 0.152: R19.2 39.79,9.11 v40.01,8.89
  Bottom 0.152: v40.01,8.89 39.89,9 PULSE.1
PULSE  (via drill 0.3)
  Top 0.152: R15.2 31.33,13.12 v31.75,12.7 | v34.29,10.16 v36.83,10.16
  Bottom 0.152: v31.75,12.7 v34.29,10.16 | PULSE.2 v36.83,10.16 J6.10
RTK_STAT  (via drill 0.3)
  Top 0.152: v25.15,28.7 24.51,28.07 12.74,28.07 R16.2 | D5.C 41.52,37.22 v40.64,38.1
  Bottom 0.152: v25.15,28.7 25.15,30.23 29.21,34.29 29.21,38.1 | 29.21,38.1 J7.7 | v40.64,38.1 29.21,38.1
RXD1/PICO  (via drill 0.3)
  Top 0.152: v25.02,35.31 24.89,35.43 12.19,35.43 8.33,31.57 8.33,17.53 9.09,16.76 R6.2
  Bottom 0.152: J7.6 26.67,36.96 v25.02,35.31 24.38,35.31 23.82,34.75 23.82,23.08 25.75,21.16 33.37,21.16 35.51,19.02 35.51,5.08 35.51,5.03 J6.8
RXD2  (via drill 0.3)
  Top 0.152: v3.17,24.13 3.17,27.3 J5.4 | R5.2 10.46,22.86 9.45,23.88 9.45,27.23 v9.65,27.43
  Bottom 0.152: J5.4 7.87,29.21 v9.65,27.43 | v3.17,24.13 3.43,23.88 3.43,7.87 5.08,6.22 20.83,6.22 21.59,5.46 J6.4
SCL/SCK  (via drill 0.3)
  Top 0.152: J2.4 7.39,39.73 v7.37,39.75 | v15.49,5.08 J4.4 | v20.57,5.08 30.48,5.08 J6.9 | v25.02,34.16 24.77,34.42 v12.7,34.42 11.97,34.42 8.89,31.34 8.89,20.07 9.14,19.81 R4.2 | R7.1 13.08,31.75 v12.7,32.13
  Bottom 0.152: v15.49,5.08 v20.57,5.08 | v25.02,34.16 24.11,33.25 24.11,23.2 25.86,21.44 33.48,21.44 35.79,19.13 35.79,2.77 J6.9 | v12.7,32.13 v12.7,34.42 12.7,36.83 11.71,37.82 10.31,37.82 8.89,39.24 7.87,39.24 v7.37,39.75 7.87,40.26 8.76,40.26 10.6,38.42 13.02,38.42 13.97,39.37 J7.1
SDA/!CS!  (via drill 0.3)
  Top 0.152: J2.3 v8.39,39.74 v8.38,39.75 | J4.3 9.39,5.49 9.95,6.05 10.84,6.05 11.33,5.56 v14.86,5.56 | v19.91,5.56 19.91,4.98 20.29,4.6 25.88,4.6 26.67,3.81 J6.6 | v22.99,33.91 v14.99,33.91 11.85,33.91 9.17,31.23 9.17,21.72 9.55,21.34 R2.2 | R8.1 v13.97,29.21
  Bottom 0.152: v8.38,39.75 8.83,39.75 10.48,38.1 14.99,38.1 | v14.86,5.56 v19.91,5.56 | v22.99,33.91 23.24,33.66 23.24,22.87 25.52,20.6 33.14,20.6 34.95,18.79 34.95,9.55 J6.6 | v13.97,29.21 13.97,33.02 14.86,33.91 v14.99,33.91 14.99,38.1 | 14.99,38.1 16.51,39.62 J7.2
SHIELD
  Top 0.406: J3.SHLD2 5.31,8.26 1.38,8.26 J3.SHLD4 | J3.SHLD1 5.31,17.14 1.38,17.14 J3.SHLD3
  Bottom 0.406: J3.SHLD4 SHLD.2 J3.SHLD3
SMA
  Top 0.813: FB1.1 32.3,25.4 32.26,25.44 | C7.1 32.23,25.46 32.26,25.44 | J1.SIG 39.3,25.47 D1.1 33.94,25.47 L1.1 32.26,25.44
TXD1/POCI  (via drill 0.3)
  Top 0.152: v23.11,34.92 12.08,34.92 8.61,31.46 8.61,18.92 9.25,18.29 R3.2
  Bottom 0.152: J7.5 24.13,35.81 23.24,34.92 v23.11,34.92 23.27,34.92 23.52,34.67 23.52,22.99 25.63,20.88 33.25,20.88 35.23,18.9 35.23,7.28 29.22,1.27 J6.7
TXD2  (via drill 0.3)
  Top 0.152: R11.2 9.78,25.18 9.78,26.54 v10.92,27.69 | v4.06,24.13 4.06,28.96 J5.5
  Bottom 0.152: J5.5 3.81,31.75 5.74,29.82 8.84,29.82 10.92,27.73 v10.92,27.69 | v4.06,24.13 3.71,23.77 3.71,7.99 5.2,6.5 23.34,6.5 24.13,5.71 J6.5
VCC_RF
  Top 0.406: R14.2 29.72,21.91 28.37,23.26 U1.9

### Text on the board
Bottom: v11
Milling: Route Out
Measures: Measurements in inches
tDocu: Solder Mask: Red | Layers: 2 | Finish: Lead-Free HASL | Thickness: 1.6mm | No clean process | N. Seidle